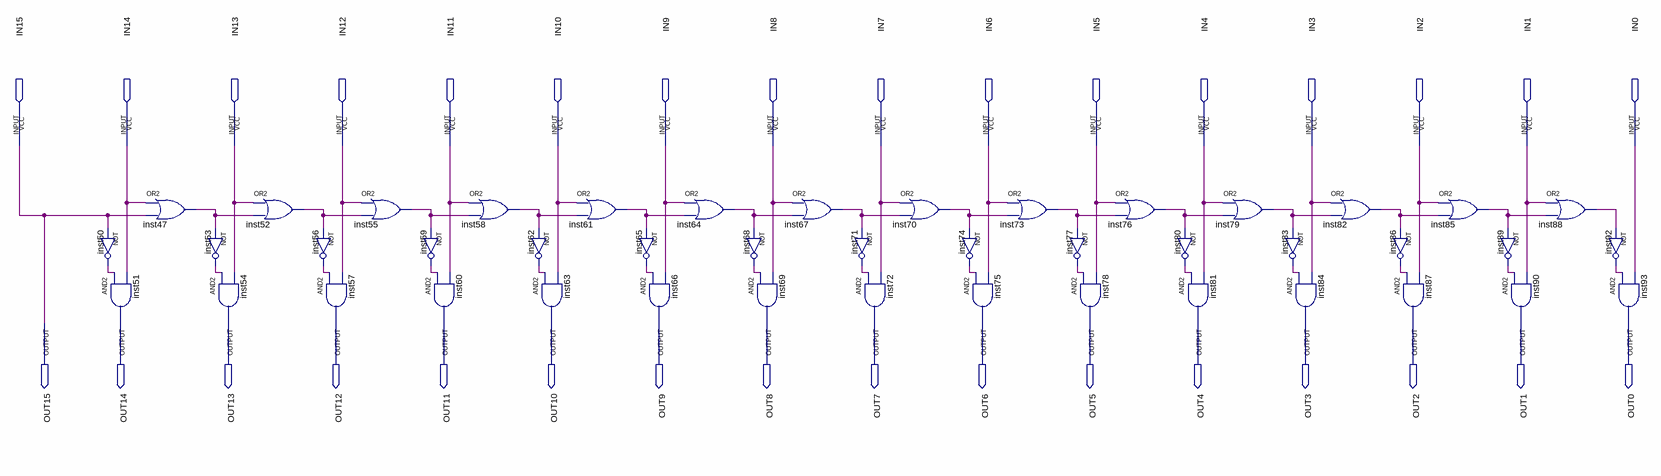
[diagram p0: schematic sheet]
// Quartus schematic hi_sw.bdf as structural Verilog: 44 symbols, 32 pins
module hi_sw (
  input  IN15,
  input  IN14,
  input  IN13,
  input  IN12,
  input  IN11,
  input  IN10,
  input  IN9,
  input  IN8,
  input  IN7,
  input  IN6,
  input  IN5,
  input  IN4,
  input  IN3,
  input  IN2,
  input  IN1,
  input  IN0,
  output OUT15,
  output OUT14,
  output OUT13,
  output OUT12,
  output OUT11,
  output OUT10,
  output OUT9,
  output OUT8,
  output OUT7,
  output OUT6,
  output OUT5,
  output OUT4,
  output OUT3,
  output OUT2,
  output OUT1,
  output OUT0
);

  wire inst47_out, inst50_out, inst52_out, inst53_out, inst55_out, inst56_out, inst58_out, inst59_out,
       inst61_out, inst62_out, inst64_out, inst65_out, inst67_out, inst68_out, inst70_out, inst71_out,
       inst73_out, inst74_out, inst76_out, inst77_out, inst79_out, inst80_out, inst82_out, inst83_out,
       inst85_out, inst86_out, inst88_out, inst89_out, inst92_out;

  not inst50 (inst50_out, IN15);
  and inst51 (OUT14, inst50_out, IN14);
  or inst47 (inst47_out, IN14, IN15);
  not inst53 (inst53_out, inst47_out);
  and inst54 (OUT13, inst53_out, IN13);
  or inst52 (inst52_out, IN13, inst47_out);
  not inst56 (inst56_out, inst52_out);
  and inst57 (OUT12, inst56_out, IN12);
  or inst55 (inst55_out, IN12, inst52_out);
  not inst59 (inst59_out, inst55_out);
  or inst58 (inst58_out, IN11, inst55_out);
  and inst60 (OUT11, inst59_out, IN11);
  not inst62 (inst62_out, inst58_out);
  and inst63 (OUT10, inst62_out, IN10);
  or inst61 (inst61_out, IN10, inst58_out);
  not inst65 (inst65_out, inst61_out);
  and inst66 (OUT9, inst65_out, IN9);
  or inst64 (inst64_out, IN9, inst61_out);
  not inst68 (inst68_out, inst64_out);
  and inst69 (OUT8, inst68_out, IN8);
  or inst67 (inst67_out, IN8, inst64_out);
  not inst71 (inst71_out, inst67_out);
  and inst72 (OUT7, inst71_out, IN7);
  or inst70 (inst70_out, IN7, inst67_out);
  not inst74 (inst74_out, inst70_out);
  and inst75 (OUT6, inst74_out, IN6);
  or inst73 (inst73_out, IN6, inst70_out);
  not inst77 (inst77_out, inst73_out);
  and inst78 (OUT5, inst77_out, IN5);
  or inst76 (inst76_out, IN5, inst73_out);
  not inst80 (inst80_out, inst76_out);
  and inst81 (OUT4, inst80_out, IN4);
  or inst79 (inst79_out, IN4, inst76_out);
  not inst83 (inst83_out, inst79_out);
  or inst82 (inst82_out, IN3, inst79_out);
  and inst84 (OUT3, inst83_out, IN3);
  not inst86 (inst86_out, inst82_out);
  and inst87 (OUT2, inst86_out, IN2);
  or inst85 (inst85_out, IN2, inst82_out);
  not inst89 (inst89_out, inst85_out);
  and inst90 (OUT1, inst89_out, IN1);
  or inst88 (inst88_out, IN1, inst85_out);
  not inst92 (inst92_out, inst88_out);
  and inst93 (OUT0, inst92_out, IN0);

  assign OUT15 = IN15;
endmodule
